# Altium schematic sheet CONTROLER.SchDoc
size A3; SheetNumber: 1; SheetTotal: 1
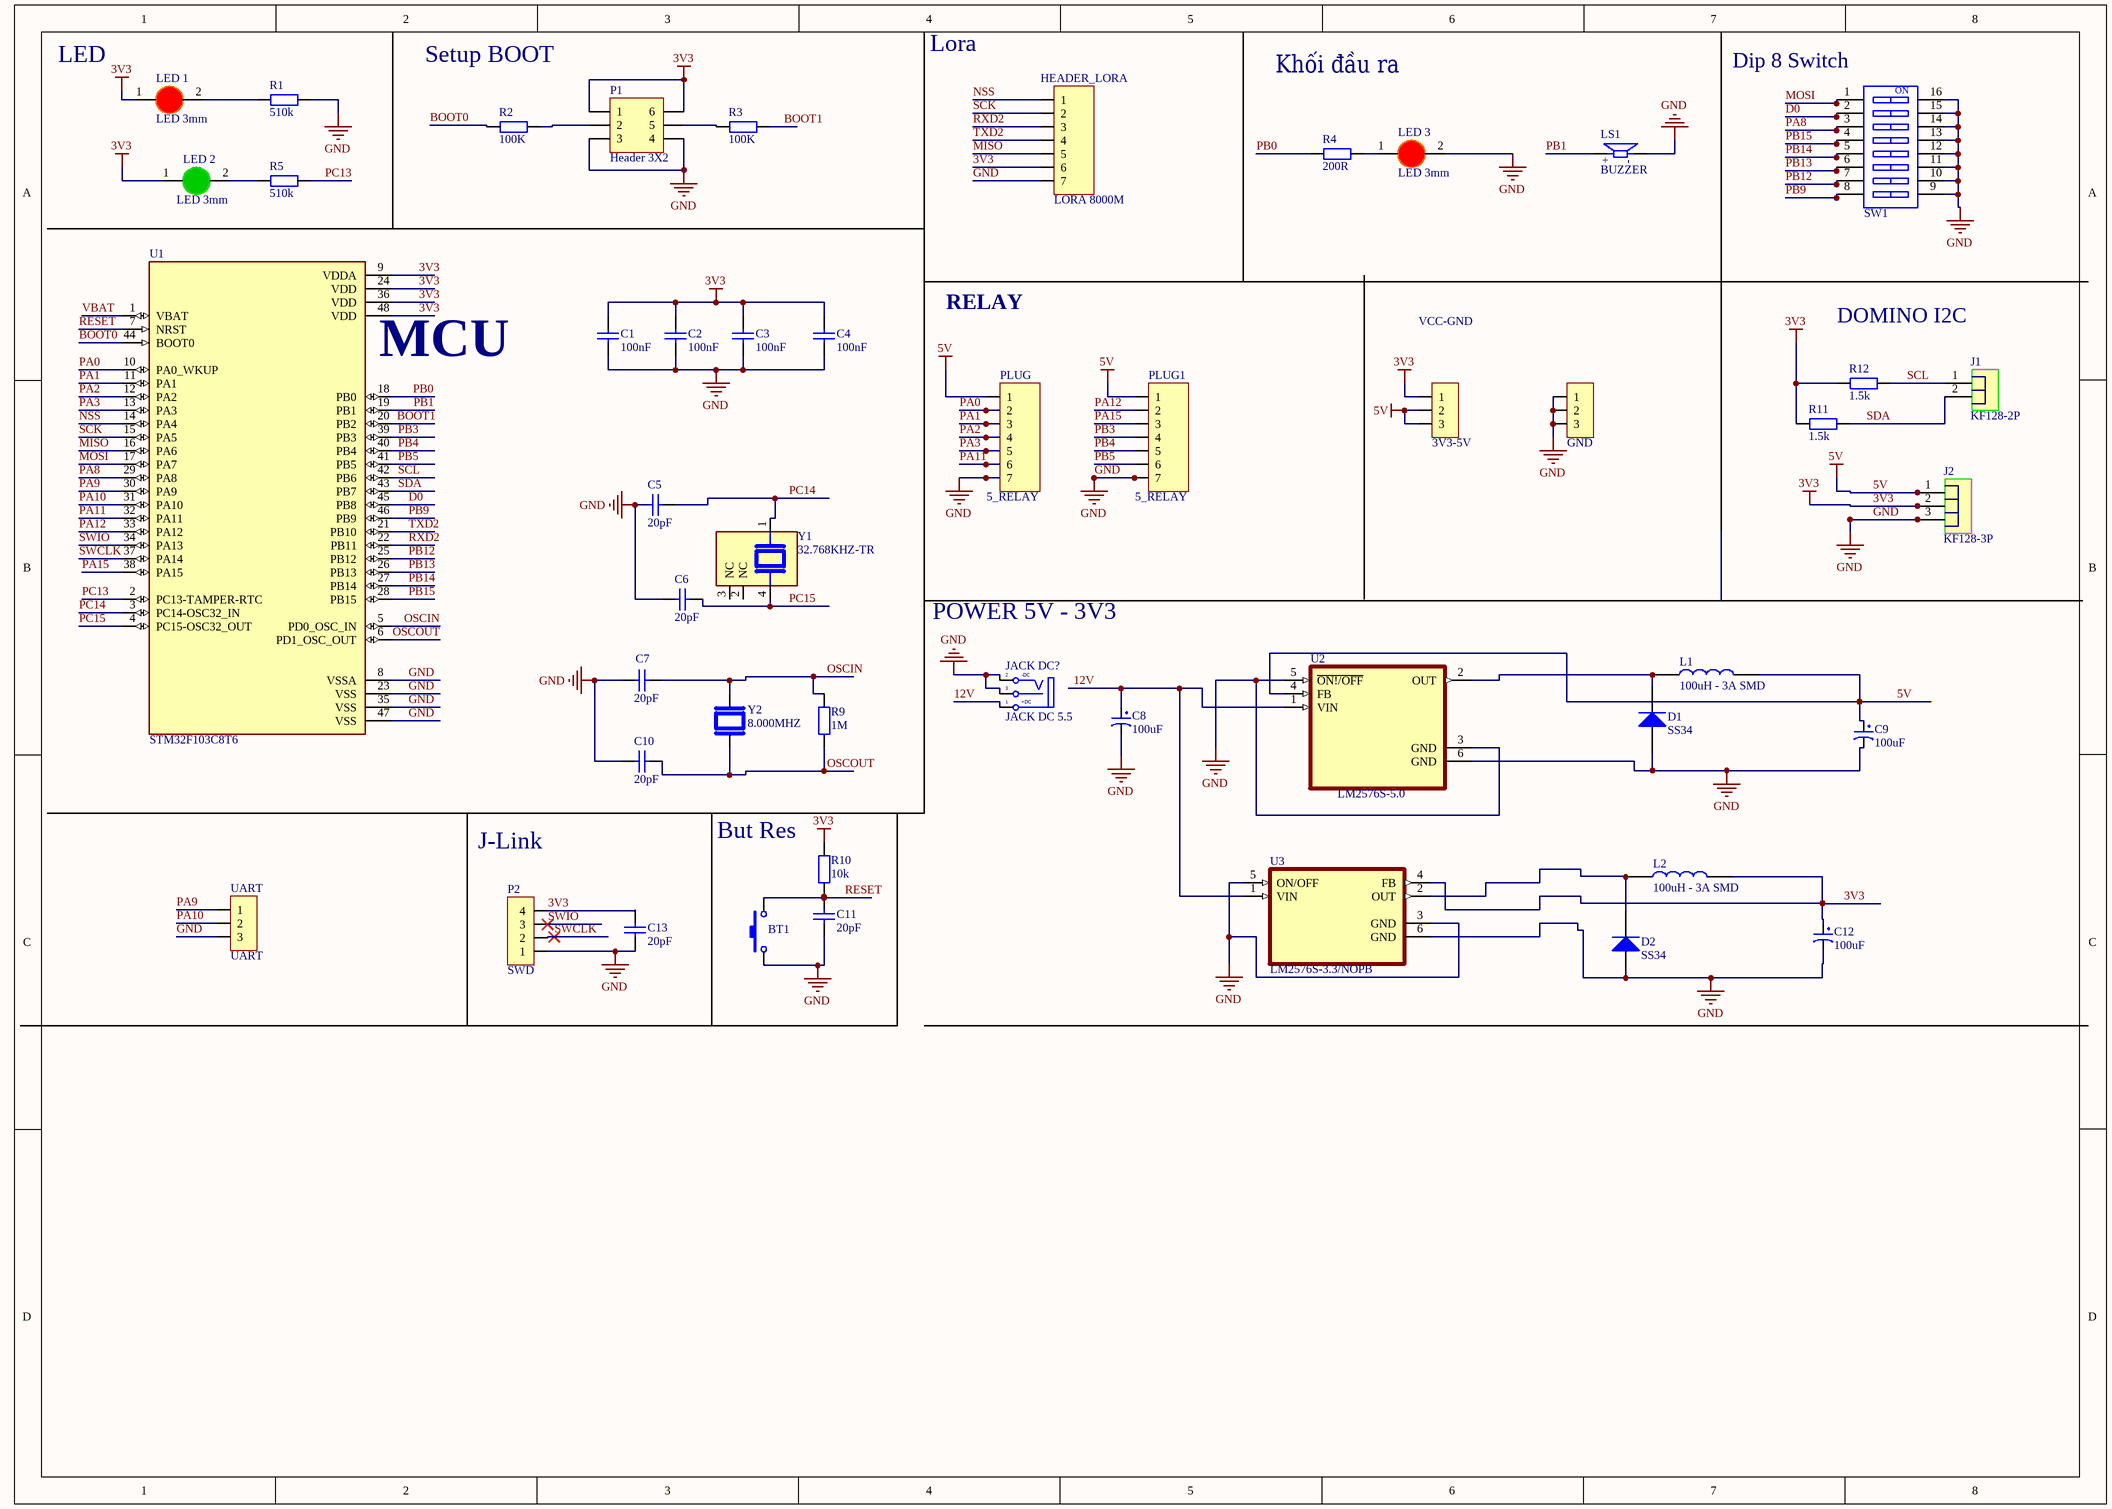
[diagram p0: CONTROLER.SchDoc]

## Parts
(Parts that share a designator on the sheet are numbered #1, #2 ... from top to bottom, then left to right.)
3V3-5V  3V3-5V  [JP 1x3 DT]
BT1  Nut Nhan 2 Chan SMD 3x6x2.5  [Nut Nhan 2 Chan SMD 3x6x2.5]  (value not drawn)
C1  100nF  [tu 0603]
C2  100nF  [tu 0603]
C3  100nF  [tu 0603]
C4  100nF  [tu 0603]
C5  20pF  [tu 0805]
C6  20pF  [tu 0805]
C7  20pF  [tu 0805]
C8  100uF  [tu tantalum smd7343]
C9  100uF  [tu tantalum smd7343]
C10  20pF  [tu 0805]
C11  20pF  [tu 0805]
C12  100uF  [tu tantalum smd7343]
C13  20pF  [tu 0805]
D1  SS34  [DIODE SMA]
D2  SS34  [DIODE SMA]
GND_3P  GND  [JP 1x3 DT]
J1  KF128-2P  [KF128-5.08-2P]
J2  KF128-3P  [KF128-5.08-3P]
JACK_DC?  JACK DC 5.5  [JACK DC 5.5]
JP?#1  LORA 8000M  [JP 1x7 CT]
JP?#2  5_RELAY  [JP 1x7 DT]
JP?#3  5_RELAY  [JP 1x7 DT]
L1  100uH - 3A SMD  [Cuon Cam 12x12x10]
L2  100uH - 3A SMD  [Cuon Cam 12x12x10]
LED_1  LED 3mm  [LED-0805-Red]
LED_2  LED 3mm  [LED-0805-Green]
LED_3  LED 3mm  [LED-0805-Red]
LS1  BUZZER  [CUI_CEM-1203(42)]
P1  Header 3X2  [JP 2x3 DT]
P2  SWD  [JP 1x4 DT]
R1  510k  [Tro SMD 0805]
R2  100K  [tro smd 1206]
R3  100K  [tro smd 1206]
R4  200R  [tro smd 1206]
R5  510k  [Tro SMD 0805]
R9  1M  [tro smd 1206]
R10  10k  [tro smd 2010]
R11  1.5k  [tro smd 0805]
R12  1.5k  [tro smd 0805]
SW1  418117270908  [418117270908]  (value not drawn)
U1  STM32F103C8T6  [QFP50P900X900X160-48N]
U2  LM2576S-5.0  [VREG_TPS79625KTTR]
U3  LM2576S-3.3/NOPB  [VREG_TPS79625KTTR]
UART  UART  [JP 1x3 DT]
Y1  32.768KHZ-TR  [XTAL_ABS25-32.768KHZ-TR]
Y2  8.000MHZ  [XTAL_ABLS-8.000MHZ-B4-T]

## Nets
3V3: 3V3-5V.1 C1.1 C2.1 C3.1 C4.1 C12.1 C13.1 J2.2 JP?#1.6 L2.2 LED_1.1(A) LED_2.1(A) P1.1 P1.6 P2.4 R10.2 R11.1 R12.1 U1.9(VDDA) U1.24(VDD) U1.36(VDD) U1.48(VDD) U3.4(FB)
5V: 3V3-5V.2 3V3-5V.3 C9.1 J2.1 JP?#2.1 JP?#3.1 L1.2 U2.4(FB)
GND: BT1.1 C1.2 C2.2 C3.2 C4.2 C5.2 C6.2 C7.2 C8.2 C9.2 C10.2 C11.2 C12.2 C13.2 D1.1(A) D2.1(A) GND_3P.1 GND_3P.2 GND_3P.3 J2.3 JACK_DC?.2(TN) JACK_DC?.3(S) JP?#1.7 JP?#2.7 JP?#3.7 LED_3.2(K) LS1.N P1.3 P1.4 P2.1 R1.2 SW1.9 SW1.10 SW1.11 SW1.12 SW1.13 SW1.14 SW1.15 SW1.16 U1.8(VSSA) U1.23(VSS) U1.35(VSS) U1.47(VSS) U2.3(GND) U2.5(~{ON!/OFF}) U2.6(GND) U3.3(GND) U3.5(ON/OFF) U3.6(GND) UART.3
12V: C8.1 JACK_DC?.1(T) U2.1(VIN) U3.1(VIN)
BOOT0: R2.1 U1.44(BOOT0)
BOOT1: R3.2 U1.20(PB2)
D0: SW1.2 U1.45(PB8)
MISO: JP?#1.5 U1.16(PA6)
MOSI: SW1.1 U1.17(PA7)
NSS: JP?#1.1 U1.14(PA4)
OSCIN: C7.1 R9.2 U1.5(PD0_OSC_IN) Y2.2
OSCOUT: C10.1 R9.1 U1.6(PD1_OSC_OUT) Y2.1
PA0: JP?#2.2 U1.10(PA0_WKUP)
PA1: JP?#2.3 U1.11(PA1)
PA2: JP?#2.4 U1.12(PA2)
PA3: JP?#2.5 U1.13(PA3)
PA8: SW1.3 U1.29(PA8)
PA9: U1.30(PA9) UART.1
PA10: U1.31(PA10) UART.2
PA11: JP?#2.6 U1.32(PA11)
PA12: JP?#3.2 U1.33(PA12)
PA15: JP?#3.3 U1.38(PA15)
PB0: R4.1 U1.18(PB0)
PB1: LS1.P U1.19(PB1)
PB3: JP?#3.4 U1.39(PB3)
PB4: JP?#3.5 U1.40(PB4)
PB5: JP?#3.6 U1.41(PB5)
PB9: SW1.8 U1.46(PB9)
PB12: SW1.7 U1.25(PB12)
PB13: SW1.6 U1.26(PB13)
PB14: SW1.5 U1.27(PB14)
PB15: SW1.4 U1.28(PB15)
PC13: R5.2 U1.2(PC13-TAMPER-RTC)
PC14: C5.1 U1.3(PC14-OSC32_IN) Y1.1
PC15: C6.1 U1.4(PC15-OSC32_OUT) Y1.4
RESET: BT1.2 C11.1 R10.1 U1.7(NRST)
RXD2: JP?#1.3 U1.22(PB11)
SCK: JP?#1.2 U1.15(PA5)
SCL: J1.1 R12.2 U1.42(PB6)
SDA: J1.2 R11.2 U1.43(PB7)
SWCLK: P2.2 U1.37(PA14)
SWIO: P2.3 U1.34(PA13)
TXD2: JP?#1.4 U1.21(PB10)
VBAT: U1.1(VBAT)
NetD1_2: D1.2(K) L1.1 U2.2(OUT)
NetD2_2: D2.2(K) L2.1 U3.2(OUT)
NetLED_1_2: LED_1.2(K) R1.1
NetLED_2_2: LED_2.2(K) R5.1
NetLED_3_1: LED_3.1(A) R4.2
NetP1_2: P1.2 R2.2
NetP1_5: P1.5 R3.1

Not connected (* = marked no-connect by the designer): Y1 2(NC) 3(NC)

## Notes on the sheet
- LED
- Setup BOOT
- Lora
- (near JP?#1) HEADER_LORA
- Khối đầu ra
- (near SW1) Dip 8 Switch
- RELAY
- (near U1) MCU
- (near JP?#2) PLUG
- (near JP?#3) PLUG1
- VCC-GND
- DOMINO I2C
- POWER 5V - 3V3
- J-Link
- (near R10) But Res
- (in symbol 418117170908) ON
- (in symbol CEM-1203(42)) +; -
- (in symbol JACK DC 5.5) -DC; +DC

## Library data of the parts
3V3-5V GND_3P UART = JP 1x3 2.54 Duc Thang: Cắm; Ten_Linh_Kien: Jump Đơn Đực 2.54MM 1x40P Thẳng 11MM; Don_Vi: Con; Ma_Hang: MH000903; Ghi_Chu: *; Kieu_Chan: *; Chung_Loai: Cắm
BT1 = Nut Nhan 2 Chan SMD 3x6x2.5: Ma_Hang: MH001036; Ten: Nút Nhấn 2 Chân 3x6x2.5MM SMD
C1-C4 = Tu 0603 104 50V 10%: Dán; Don_Vi: Con; So_Chan: 2; Ten_Linh_Kien: Tụ 0603 104-100nF 10% 50V; Ma_Hang: MH004568; Chung_Loai: Dán; Kieu_Chan: *
C5-C7 C10 C11 C13 = Tu 0805 20pF 50V 10%: Dán; Don_Vi: Con; Ten_Linh_Kien: Tụ 0805 20P 10% 50V; So_Chan: 2; Ma_Hang: MH004558; Chung_Loai: Dán; Kieu_Chan: *
C8 C9 C12 = Tu tantalum 100uF 25V SMD7343: Dán; Don_Vi: Con; So_Chan: 2; Ten_Linh_Kien: Tụ tantalum 107E-100uF 25V SMD7343; Ma_Hang: MH002347; Chung_Loai: Dán; Kieu_Chan: *
D1 D2 = Diode SS34 ( 1N5822 ): Dán; Don_Vi: Con; Ma_Hang: MH002104; Ten_Linh_Kien: Diode SS34 3A 40V SMA ( 1N5822 SS34A); Kieu_Chan: *; Chung_Loai: Dán
JACK_DC? = JACK DC 5.5: Value: Jac DC
JP?#1 = JP 1x7 2.54 Cai Thang: Cắm; Ten_Linh_Kien: Jump Đơn Cái 2.54MM 1x20P Thẳng; Don_Vi: Con; Ma_Hang: MH004006; Ghi_Chu: *; Kieu_Chan: *; Chung_Loai: Cắm
JP?#2 JP?#3 = JP 1x7 2.54 Duc Thang: Cắm; Ten_Linh_Kien: Jump Đơn Đực 2.54MM 1x40P Thẳng 11MM; Don_Vi: Con; Ma_Hang: MH000903; Ghi_Chu: *; Kieu_Chan: *; Chung_Loai: Cắm
L1 L2 = CUON CAM 100uH SMD: Dán; Don_Vi: Con; Ma_Hang: MH003999; Ten_Linh_Kien: Cuộn Cảm 100uH 7x7x4MM CD74; Ma_Hang: *; Kieu_Chan: *; Chung_Loai: Dán
LED_1 LED_3 = LED 0805 Do: Dán; Don_Vi: Con; Ma_Hang: MH000897; Ten_Linh_Kien: LED 0805 Màu Đỏ (Red); Ghi_Chu: *; Kieu_Chan: *; Chung_Loai: Dán
LED_2 = LED 0805 Xanh La: Dán; Don_Vi: Con; Ma_Hang: MH002326; Ten_Linh_Kien: LED 0805 Màu Xanh Lá (Green); Ghi_Chu: *; Kieu_Chan: *; Chung_Loai: Dán
LS1 = CEM-1203(42): 12 mm, 3.5 V, 85 dB, Through Hole, Magnetic Audio Transducer Buzzer; MF: CUI Devices; Package: None; Price: None; Check_prices: https://www.snapeda.com/parts/CEM-1203(42)/CUI+Devices/view-part/?ref=eda; Value: *; CUI_purchase_URL: https://www.cuidevices.com/product/audio/buzzers/audio-transducers/cem-1203(42)?utm_source=snapeda.com&utm_medium=referral&utm_campaign=snapedaBOM; SnapEDA_Link: https://www.snapeda.com/parts/CEM-1203(42)/CUI+Devices/view-part/?ref=snap; MP: CEM-1203(42); Availability: In Stock; Purchase-URL: https://pricing.snapeda.com/search/part/CEM-1203(42)/?ref=eda
P1 = JP 2x3 2.54 Duc Thang: Cắm; Ten_Linh_Kien: Jump Đôi Đực 2.54MM 2x40P Thẳng 11MM; Don_Vi: Con; Ma_Hang: MH002686; Ghi_Chu: *; Kieu_Chan: *; Chung_Loai: Cắm
P2 = JP 1x4 2.54 Duc Thang: Cắm; Ten_Linh_Kien: Jump Đơn Đực 2.54MM 1x40P Thẳng 11MM; Don_Vi: Con; Ma_Hang: MH000903; Ghi_Chu: *; Kieu_Chan: *; Chung_Loai: Cắm
R1 R5 = Tro 0805 5% 510k: Dán; Don_Vi: Con; Ma_Hang: MH007566; Ten_Linh_Kien: Trở 0805 5% 510k; So_Chan: 2; Chung_Loai: Dán; Kieu_Chan: *
R2 R3 = Tro 1206 5% 100K: Dán; Don_Vi: Con; So_Chan: 2; Ten_Linh_Kien: Trở 1206 5% 100k; Ma_Hang: MH005921; Chung_Loai: Dán; Kieu_Chan: *
R4 = Tro 1206 1% 200R: Dán; So_Chan: 2; Don_Vi: Con; Ten_Linh_Kien: Trở 1206 1% 200R; Ma_Hang: MH005895; Chung_Loai: Dán; Kieu_Chan: *
R9 = Tro 1206 1% 1M: Dán; Don_Vi: Con; So_Chan: 2; Ten_Linh_Kien: Trở 1206 1% 1M; Ma_Hang: MH005881; Chung_Loai: Dán; Kieu_Chan: *
R10 = Tro 2010 5% 10k: Dán; Don_Vi: Con; So_Chan: 2; Ten_Linh_Kien: Trở 2010 5% 103-10k; Ma_Hang: MH005617; Chung_Loai: Dán; Kieu_Chan: *
R11 R12 = Tro 0805 5% 1.5k: Dán; Don_Vi: Con; So_Chan: 2; Ten_Linh_Kien: Trở 0805 5% 1.5k; Ma_Hang: MH005232; Chung_Loai: Dán; Kieu_Chan: *
SW1 = 418117170908: WS-DITV Compact THT Dip Switch, Flat Actuator, pitch 2.54mm, 8p; Manufacturer: Wurth Elektronik; Actuator Type: Flat Type; Operation Force: 800g; Rated Current Non-Switching: 100mA; Rated Current Switching: 25mA; Rated Voltage Non-Switching: 50VDC; Rated Voltage Switching: 24VDC; Number of Poles: 8; ComponentLink1Description: Website Link; ComponentLink1URL: https://www.we-online.com/redexpert/article/418117170908?ad; ComponentLink2Description: Datasheet Link; ComponentLink2URL: https://www.we-online.com/redexpert/spec/418117170908?ad; Manufacturer Part Number: 418117170908; Category: Dip Switches; Match Code: WS-DITV; Mount: Through Hole; Operating Temperature Max: 85°C; Operating Temperature Min: -40°C; Packaging: Tube; Contact Material: Copper Alloy; Contact Plating: Gold; Pitch: 2.54mm
U1 = STM32F103C8T6: ARM® Cortex®-M3 STM32F1 Microcontroller IC 32-Bit 72MHz 64KB (64K x 8) FLASH 48-LQFP (7x7); MF: STMicroelectronics; SnapEDA_Link: https://www.snapeda.com/parts/STM32F103C8T6/STMicroelectronics/view-part/?ref=snap; Package: LQFP-48 STMicroelectronics; Value: *; MP: STM32F103C8T6; Check_prices: https://www.snapeda.com/parts/STM32F103C8T6/STMicroelectronics/view-part/?ref=eda
U2 = LM2576S-5.0: SIMPLE SWITCHER&#174; 40V, 3A Low Component Count Step-Down Regulator; MF: Texas Instruments; MP: LM2576S-5.0/NOPB; Price: None; Texas_Instruments-Purchase-URL: https://snapeda.com/shop?store=Texas+Instruments&id=227071; Availability: Unavailable; SnapEDA_Link: https://www.snapeda.com/parts/LM2576S-5.0/NOPB/Texas%20Instruments/view-part/227071/?ref=snap; Mouser-Purchase-URL: https://snapeda.com/shop?store=Mouser&id=227071; Value: *; Package: TO-263-5 Texas Instruments; DigiKey-Purchase-URL: https://snapeda.com/shop?store=DigiKey&id=227071
U3 = LM2576S-3.3/NOPB: SWITCHER Ø³Ø§Ø¯Ù‡ Ùˆ regØ› 40 ÙˆÙ„Øª ØŒ 3A ØªÙ†Ø¸ÛŒÙ… Ú©Ù†Ù†Ø¯Ù‡ Ú¯Ø§Ù… Ø¨Ù‡ Ù¾Ø§ÛŒÛŒÙ† ØªØ¹Ø¯Ø§Ø¯ Ú©Ø§Ù…Ù¾ÙˆÙ†Ù†Øª Ú©Ù… 5-DDPAK / TO-263 -40 ØªØ§ 125; MF: Texas Instruments; Availability: Unavailable; Texas_Instruments-Purchase-URL: https://snapeda.com/shop?store=Texas+Instruments&id=214965; Value: *; Package: TO-263-5 Texas Instruments; Price: None; MP: LM2576S-3.3/NOPB; SnapEDA_Link: https://www.snapeda.com/parts/LM2576S-3.3/NOPB/Texas%20Instruments/view-part/214965/?ref=snap
Y1 = ABS25-32.768KHZ-TR: Crystal 0.032768MHz Â±20ppm (Tol) 12.5pF FUND 50000Ohm 4-Pin SMD T/R; MF: Abracon Corporation; SnapEDA_Link: https://www.snapeda.com/parts/ABS25-32.768KHZ-TR/Abracon/view-part/?ref=snap; Package: Package; Value: *; MP: ABS25-32.768KHZ-TR; Check_prices: https://www.snapeda.com/parts/ABS25-32.768KHZ-TR/Abracon/view-part/?ref=eda
Y2 = ABLS-8.000MHZ-B4-T: HC/49US (AT49) SMD LOW PROFILE CRYSTAL; MF: Abracon LLC; Package: None; Value: *; Check_prices: https://www.snapeda.com/parts/ABLS-8.000MHZ-B4-T/Abracon+LLC/view-part/?ref=eda; Purchase-URL: https://pricing.snapeda.com/search/part/ABLS-8.000MHZ-B4-T/?ref=eda; MP: ABLS-8.000MHZ-B4-T; SnapEDA_Link: https://www.snapeda.com/parts/ABLS-8.000MHZ-B4-T/Abracon+LLC/view-part/?ref=snap; Digi-Key_Part_Number: 535-10212-2-ND